# Altium project Length Bar Comparator.PrjPcb (part 1 of 3)
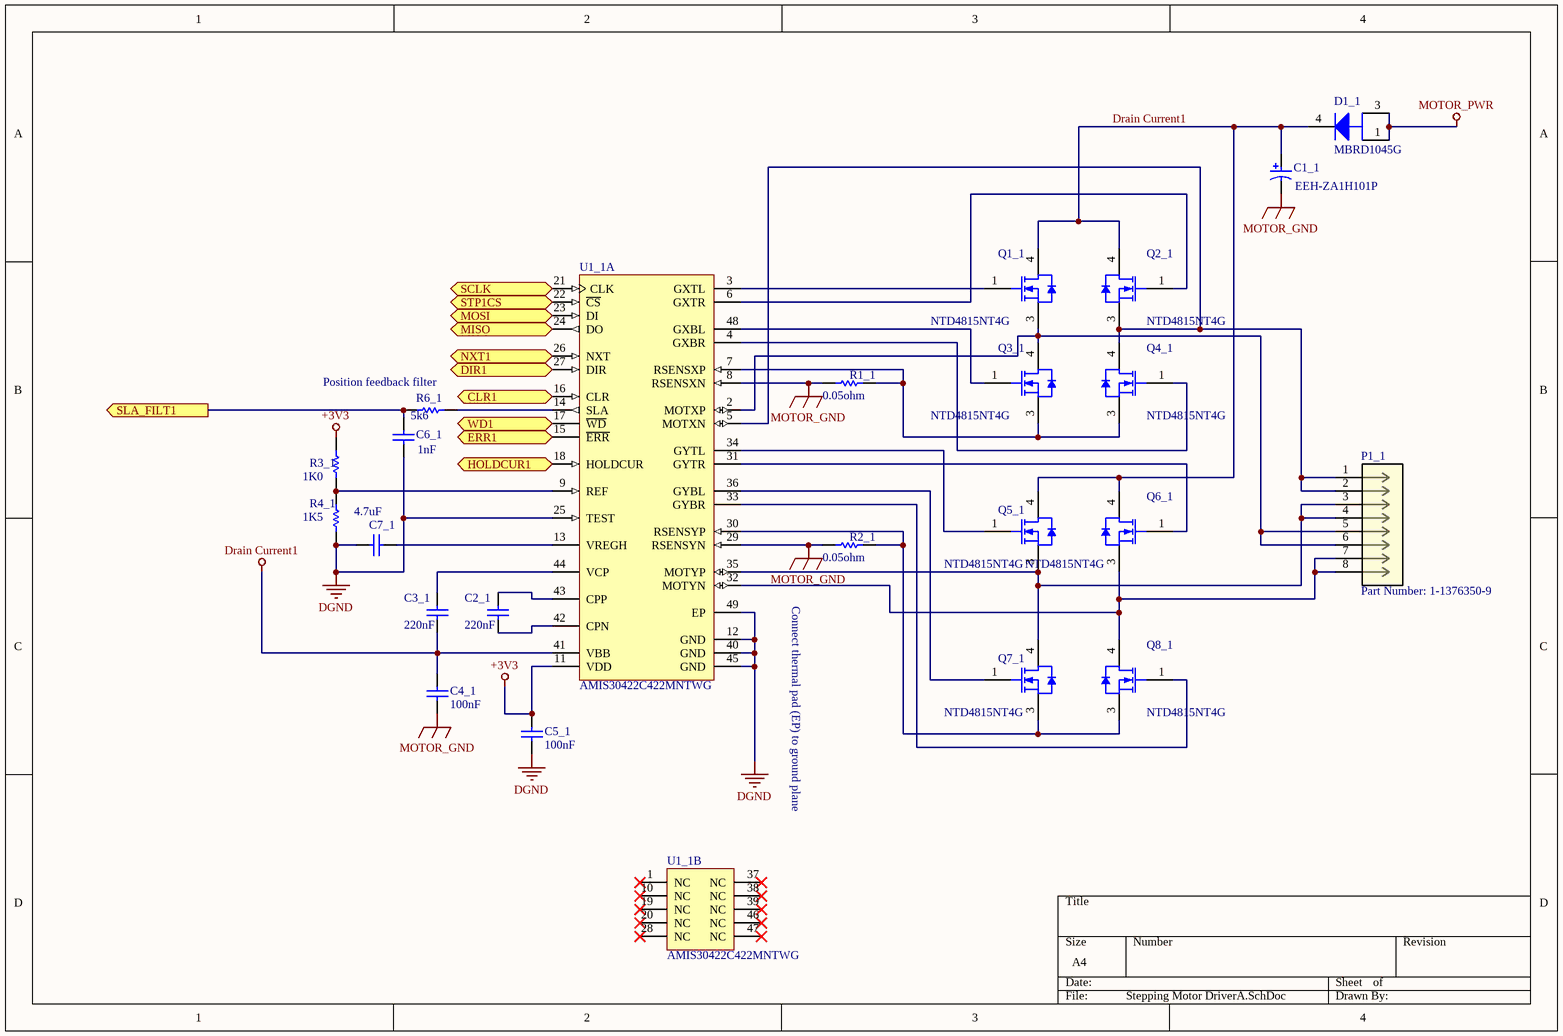
[diagram p0: Stepping Motor DriverA.SchDoc]
11 sheets, 462 parts. Net scope: flat (ports and power ports of the same name join across sheets).
Board file: Length Bar Comparator.PcbDoc
Sheets:
  Stepping Motor DriverA.SchDoc
  Stepping Motor DriverB.SchDoc
  Stepping Motor DriverC.SchDoc
  Stepping Motor DriverD.SchDoc
  Stepping Motor DriverE.SchDoc
  Stepping Motor DriverF.SchDoc
  Microprocessor.SchDoc
  LVDT Driver.SchDoc
  Power Regulation.SchDoc
  Reference Voltage.SchDoc
  Amplifiers.SchDoc

## Sheet Stepping Motor DriverA.SchDoc
size A4

### Parts
C1_1  EEH-ZA1H101P  [PNSC-ZA-G_L]
C2_1  value 220nF  [CAPC0805(2012)75_L]  (hidden comment: CAP 220nF 50V 0805(2012))
C3_1  value 220nF  [CAPC0805(2012)75_L]  (hidden comment: CAP 220nF 50V 0805(2012))
C4_1  value 100nF  [CAPC1812(4532)110_N]  (hidden comment: CAP 100nF 50V 1812(4532))
C5_1  value 100nF  [CAPC1812(4532)110_N]  (hidden comment: CAP 100nF 50V 1812(4532))
C6_1  value 1nF  [CAPC1206(3216)170_N]  (hidden comment: CAP 1nF 50V 1206(3216))
C7_1  value 4.7uF  [CAPC2220(5750)230_L]  (hidden comment: CAP 4.7uF 50V 2220(5750))
D1_1  MBRD1045G  [ONSC-DPAK-3-369C-01_V]
P1_1  Part Number: 1-1376350-9  [conn8_1-1376350-]
Q1_1  NTD4815NT4G  [ONSC-DPAK-3-369AA-01_V]
Q2_1  NTD4815NT4G  [ONSC-DPAK-3-369AA-01_V]
Q3_1  NTD4815NT4G  [ONSC-DPAK-3-369AA-01_V]
Q4_1  NTD4815NT4G  [ONSC-DPAK-3-369AA-01_V]
Q5_1  NTD4815NT4G  [ONSC-DPAK-3-369AA-01_V]
Q6_1  NTD4815NT4G  [ONSC-DPAK-3-369AA-01_V]
Q7_1  NTD4815NT4G  [ONSC-DPAK-3-369AA-01_V]
Q8_1  NTD4815NT4G  [ONSC-DPAK-3-369AA-01_V]
R1_1  Resistance: 0.05ohm  [RESC6432X89X76LL25T25]  (hidden comment: WSL2512R0500FEA)
R2_1  Resistance: 0.05ohm  [RESC6432X89X76LL25T25]  (hidden comment: WSL2512R0500FEA)
R3_1  value 1K0  [RESC0805(2012)_M]  (hidden comment: 1K 1% 0805(2012))
R4_1  value 1K5  [RESC0805(2012)_M]  (hidden comment: 1K5 1% 0805(2012))
R6_1  value 5k6  [RESC0805(2012)_L]  (hidden comment: 5K6 1% 0805(2012))
U1_1  AMIS30422C422MNTWG  [ONSC-QFN-48-485AJ-01_V]  (parts A,B of 2)

### Ports
CLR1 (in), DIR1 (in), ERR1 (out), HOLDCUR1 (in), MISO (out), MOSI (in), NXT1 (in), SCLK (in), SLA_FILT1 (out), STP1CS (in), WD1 (out)

### Nets
+3V3: C5_1.2 R3_1.2 U1_1.11(VDD)
DGND: C5_1.1 C6_1.1 C7_1.1 R4_1.1 U1_1.12(GND) U1_1.25(TEST) U1_1.40(GND) U1_1.45(GND) U1_1.49(EP)
Drain Current1: C1_1.1 C3_1.1 C4_1.2 D1_1.4(K) Q1_1.4(D) Q2_1.4(D) Q5_1.4(D) Q6_1.4(D) U1_1.41(VBB)
MOTOR_GND: C1_1.2 C4_1.1 R1_1.1 R2_1.1 U1_1.8(RSENSXN) U1_1.29(RSENSYN)
MOTOR_PWR: D1_1.1(A) D1_1.3(A)
MISO: U1_1.24(DO) ; port MISO
MOSI: U1_1.23(DI) ; port MOSI
SCLK: U1_1.21(CLK) ; port SCLK
NetC2_1_1: C2_1.1 U1_1.42(CPN)
NetC2_1_2: C2_1.2 U1_1.43(CPP)
NetC3_1_2: C3_1.2 U1_1.44(VCP)
NetC6_1_2: C6_1.2 R6_1.1 ; port SLA_FILT1
NetC7_1_2: C7_1.2 U1_1.13(VREGH)
NetP1_1_1: P1_1.1 P1_1.2 Q2_1.3(S) Q4_1.4(D) U1_1.5(MOTXN)
NetP1_1_3: P1_1.3 P1_1.4 Q5_1.3(S) Q7_1.4(D) U1_1.35(MOTYP)
NetP1_1_5: P1_1.5 P1_1.6 Q1_1.3(S) Q3_1.4(D) U1_1.2(MOTXP)
NetP1_1_7: P1_1.7 P1_1.8 Q6_1.3(S) Q8_1.4(D) U1_1.32(MOTYN)
NetQ1_1_1: Q1_1.1(G) U1_1.3(GXTL)
NetQ2_1_1: Q2_1.1(G) U1_1.6(GXTR)
NetQ3_1_1: Q3_1.1(G) U1_1.48(GXBL)
NetQ3_1_3: Q3_1.3(S) Q4_1.3(S) R1_1.2 U1_1.7(RSENSXP)
NetQ4_1_1: Q4_1.1(G) U1_1.4(GXBR)
NetQ5_1_1: Q5_1.1(G) U1_1.34(GYTL)
NetQ6_1_1: Q6_1.1(G) U1_1.31(GYTR)
NetQ7_1_1: Q7_1.1(G) U1_1.36(GYBL)
NetQ7_1_3: Q7_1.3(S) Q8_1.3(S) R2_1.2 U1_1.30(RSENSYP)
NetQ8_1_1: Q8_1.1(G) U1_1.33(GYBR)
NetR3_1_1: R3_1.1 R4_1.2 U1_1.9(REF)
NetR6_1_2: R6_1.2 U1_1.14(SLA)
NetU1_1_15: U1_1.15(~{ERR}) ; port ERR1
NetU1_1_16: U1_1.16(CLR) ; port CLR1
NetU1_1_17: U1_1.17(~{WD}) ; port WD1
NetU1_1_18: U1_1.18(HOLDCUR) ; port HOLDCUR1
NetU1_1_22: U1_1.22(~{CS}) ; port STP1CS
NetU1_1_26: U1_1.26(NXT) ; port NXT1
NetU1_1_27: U1_1.27(DIR) ; port DIR1

Not connected (* = marked no-connect by the designer): U1_1 1(NC)* 10(NC)* 19(NC)* 20(NC)* 28(NC)* 37(NC)* 38(NC)* 39(NC)* 46(NC)* 47(NC)*

### Notes on the sheet
- (near R6_1) Position feedback filter
- Connect thermal pad (EP) to ground plane

### Library data of the parts
C1_1 = CMP-2000-06221-1: Conductive Polymer Hybrid Aluminum Electrolytic Capacitor, 100 uF, +/- 20%, 50 V, -55 to 105 degC, 2-Pin SMD (G), RoHS, Tape and Reel; Case Height: 10.5mm; Voltage Rating DC: 50V; Case Diameter: 10mm; Ripple Current: 2A; Load Life: 10000Hour; Brand: Panasonic; Case Length: 10.2mm; ESR: 28mOhms; Capacitance: 100uF; Manufacturer URL: http://www.panasonic.com/; Minimum Operating Temperature: -55C; Datasheet Version: 06/2016; Product Category: AluminumOrganicPolymerCapacitors; Maximum Operating Temperature: +105C; Package Description: 2-Pin Surface Mount Device, Body 10.3 x 10.3 mm; Package Reference: ZA-G; RoHS: Details; Series: ZA; Tolerance: 20%; Product: AluminumElectrolyticCapacitors; Factory Pack Quantity: 500; Manufacturer: Panasonic; Termination Style: SMD/SMT; Datasheet URL: https://industrial.panasonic.com/cdbs/www-data/pdf/RDD0000/DMD0000COL56.pdf; Mounting Technology: SurfaceMount; Packaging: Reel; Height: 10.5mm
C2_1 C3_1 = CMP-1036-04556-1: CAP 220nF 50V -20% to +80% 0805 (2012 Metric) Thickness 0.75mm SMD; Case-Metric: 2012; Case-EIA: 0805; Technology: SMT; Max Thickness: 0.75 mm; Rated Voltage: 50 V; Tolerance: -20% to +80%
C4_1 C5_1 = CMP-1040-01292-1: CAP 100nF 50V ±20% 1812 (4532 Metric) Thickness 1.1mm SMD; Case-EIA: 1812; Tolerance: Â±20%; Case-Metric: 4532; Rated Voltage: 50 V; Technology: SMT; Max Thickness: 1.1 mm
C6_1 = CMP-1037-02447-1: CAP 1nF 50V ±2% 1206 (3216 Metric) Thickness 1.7mm SMD; Case-Metric: 3216; Case-EIA: 1206; Tolerance: Â±2%; Technology: SMT; Max Thickness: 1.7 mm; Rated Voltage: 50 V
C7_1 = CMP-1042-00755-1: CAP 4.7uF 50V ±10% 2220 (5750 Metric) Thickness 2.2mm SMD; Case-Metric: 5750; Tolerance: Â±10%; Case-EIA: 2220; Rated Voltage: 50 V; Max Thickness: 2.2 mm; Technology: SMT
D1_1 = CMP-1055-00174-1: SWITCHMODE(TM) Schottky Power Rectifier, 3-Pin DPAK, Pb-Free, Tube; Manufacturer: On Semiconductor; Note1: 0; IFSM Max (A): 70; Configuration: Single; ComponentLink2URL: http://www.onsemi.cn/pub_link/Collateral/MBRB1045-D.PDF; PackageVersion: Rev. E, 02/2014; PackageDescription: 3-Pin Flange Mount, Body 6.54 x 6.095 mm, Pitch 2.29 mm; ComponentLink2Description: Datasheet; Packing: Tube; RoHS: TRUE; ComponentLink3Description: Package Specification; PackageReference: DPAK-3-369C-01; ComponentLink1URL: http://www.onsemi.com/; DatasheetVersion: Rev. 8; ComponentLink1Description: Manufacturer URL; PartNumber: MBRD1045G; Mounting Technology: Surface Mount; ComponentLink3URL: http://www.onsemi.cn/pub_link/Collateral/369C.PDF
P1_1 = 1-1376350-9: 025 8POS CAP ASSY H TIN; Vendor: TE Connectivity; Built_By: Digital_Papaya_Team; ROWS/CONFIG: 2; PITCH(MM): 0.087; POSITIONS: 8; Copyright: Copyright (C) 2018 Accelerated Designs. All rights reserved; Manufacturer_Part_Number: 1-1376350-9; Datasheet: https://www.te.com/commerce/DocumentDelivery/DDEController?Action=showdoc&DocId=Customer+Drawing%7F1376350%7FD5%7Fpdf%7FJapanese%7FJPN_CD_1376350_D5.pdf%7F1-1376350-2; TE_Part_Number: 1-1376350-9; PRODUCT: -; Type: DEV; RefDes: RefDes; Value: Value
Q1_1 Q2_1 Q3_1 Q4_1 Q5_1 Q6_1 Q7_1 Q8_1 = CMP-1058-00298-1: Power MOSFET, 30 V, 35 A, Single N-Channel, 3-Pin DPAK, Pb-Free, Tape and Reel; Manufacturer: On Semiconductor; VGS(th) Max (V): 2.5; VGS Max (V): 20; ID Max (A): 35; Crss Typ (pF): 108; Coss Typ (pF): 181; Channel Polarity: N Channel; V(BR)DSS Min (V): 30; Ciss Typ (pF): 770; Qrr Typ (nC): 5.5; RoHS: Pb-Free; ComponentLink3Description: Package Specification; ComponentLink2URL: http://www.onsemi.cn/pub_link/Collateral/NTD4815N-D.PDF; ComponentLink1Description: Manufacturer URL; DatasheetVersion: Rev. 7; ComponentLink3URL: http://www.onsemi.cn/pub_link/Collateral/369AA.PDF; Package Type: DPAK-3, IPAK-3; PartNumber: NTD4815NT4G; Configuration: Single; PackageVersion: Rev. B, 06/2010; ComponentLink2Description: Datasheet; Mounting Technology: Surface Mount; PackageReference: DPAK-3-369AA-01; ComponentLink1URL: http://www.onsemi.com/; PackageDescription: 3-Pin Flange Mount, Body 6.54 x 6.095 mm, Pitch 2.29 mm; Packing: Tape and Reel
R1_1 R2_1 = CMP-2000-07420-1: Chip Resistor, 50 mOhm, +/- 1%, 1 W, -65 to 170 degC, 2512 (6432 Metric), RoHS, Tape and Reel; Manufacturer: Vishay; Power Rating: 1W; Automotive Qualification Standard: AEC-Q200; Temperature Coefficient: ±75ppm/°C; Resistor Case Style: 2512[6432Metric]; SVHC: NoSVHC(15-Jun-2015); Product Range: WSLSeries; Resistor Element Type: MetalStrip; Manufacturer URL: http://www.vishay.com/; Datasheet Version: 07/2016; Package Reference: 2512; Resistance Tolerance: ±1%; Datasheet URL: http://www.vishay.com/docs/30100/wsl.pdf; Mounting Technology: SurfaceMount; MSL: MSL1-Unlimited; Package Description: 2-Pin Surface Mount Device, Body 6.35 x 3.18 mm; Packaging: CutTape
R3_1 = CMP-1013-00510-1: 1K 0.125W 1% 0805 (2012 Metric)  SMD; Case-Metric: 2012; Case-EIA: 0805; Tolerance: 1 %; Power: 0.125 W; Technology: SMT
R4_1 = CMP-1013-00528-1: 1K5 0.125W 1% 0805 (2012 Metric)  SMD; Case-Metric: 2012; Case-EIA: 0805; Technology: SMT; Power: 0.125 W; Tolerance: 1 %
R6_1 = CMP-1013-00595-1: 5K6 0.125W 1% 0805 (2012 Metric)  SMD; Case-EIA: 0805; Case-Metric: 2012; Technology: SMT; Power: 0.125 W; Tolerance: 1 %
U1_1 = CMP-1325-00002-1: Micro-Stepping Stepper Motor Bridge Controller, 6 to 30 V, -40 to 170 degC, 48-Pin QFN (485AJ-01), RoHS, Tape and Reel; Manufacturer: ON Semiconductor; IO Max (A): 15; Feedback Method: Back EMF/Sensorless; VCC Min (V): 6; IO Peak Max (A): 20; Current Sense: External Resistor; VCC Max (V): 30; ComponentLink1Description: Manufacturer URL; DatasheetVersion: Rev. 0; PackageDescription: 48-Pin Quad Flat No-Lead Package, Body 7 x 7 mm, Pitch 0.5 mm; Packing: Tape and Reel; Mounting Technology: Surface Mount; ComponentLink2Description: Datasheet; ComponentLink3URL: http://www.onsemi.cn/pub_link/Collateral/485AJ.PDF; Type: Stepper; ComponentLink2URL: http://www.onsemi.com/pub_link/Collateral/AMIS-30422-D.PDF; ComponentLink3Description: Package Specification; PackageReference: QFN-48-485AJ-01; PartNumber: AMIS30422C422MNTWG; PackageVersion: Rev. O; ComponentLink1URL: http://www.onsemi.com/; RoHS: TRUE; PartId: 1

## Sheet Stepping Motor DriverB.SchDoc
size A4
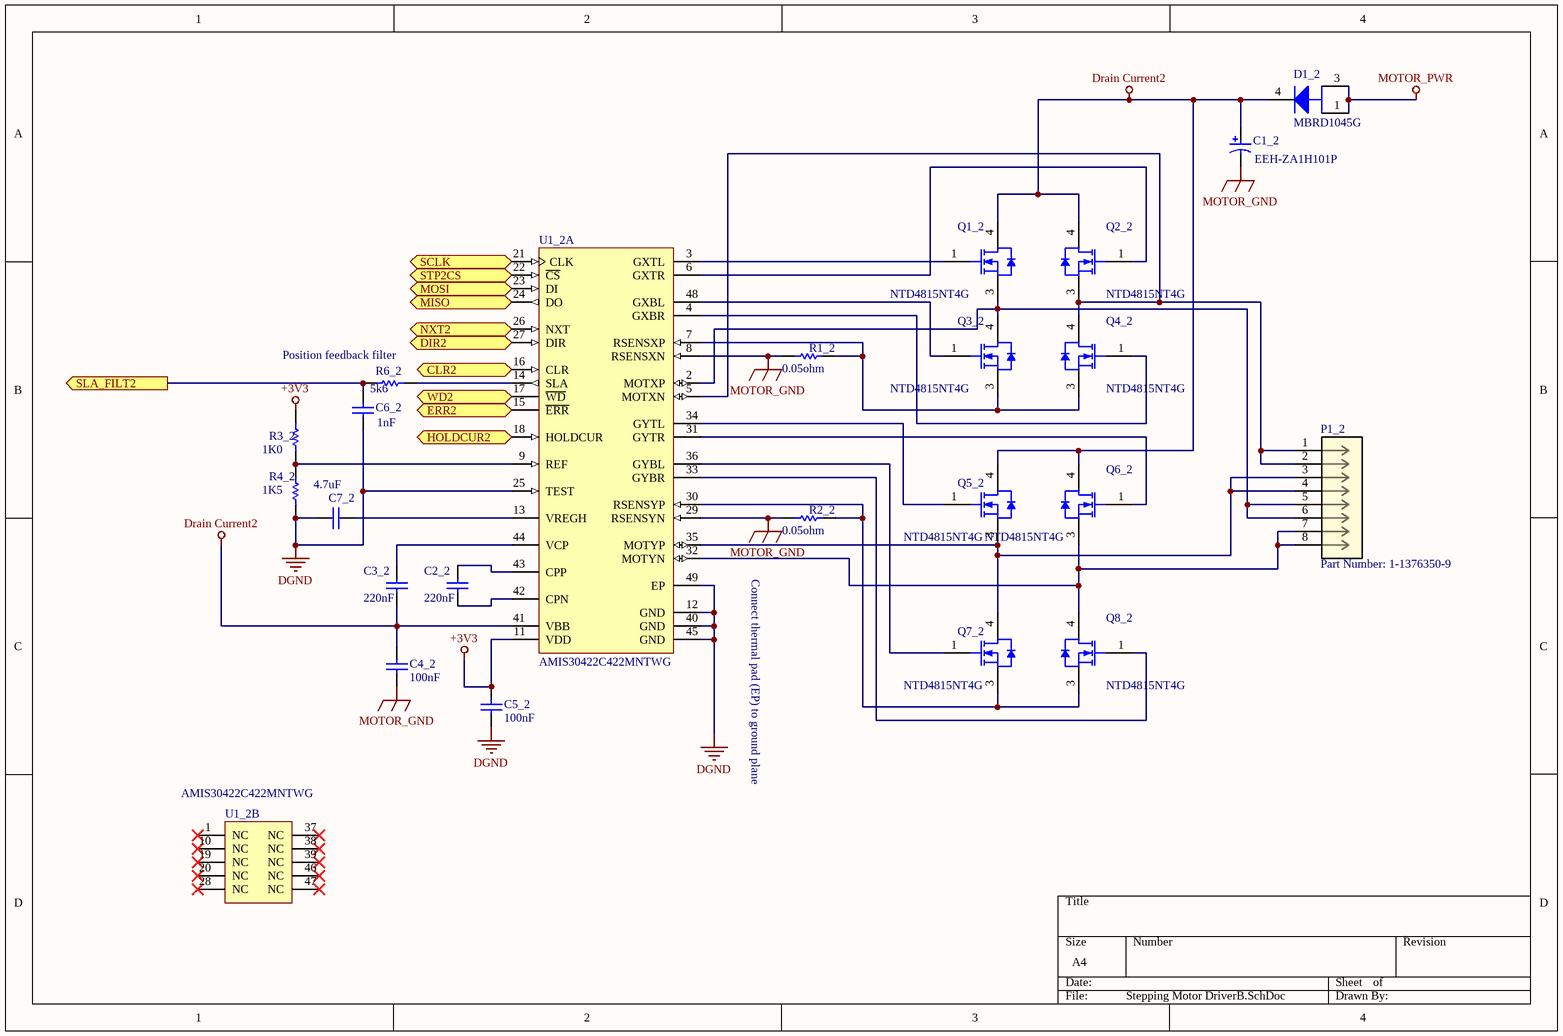
[diagram p1: Stepping Motor DriverB.SchDoc]

### Parts
C1_2  EEH-ZA1H101P  [PNSC-ZA-G_L]
C2_2  value 220nF  [CAPC0805(2012)75_L]  (hidden comment: CAP 220nF 50V 0805(2012))
C3_2  value 220nF  [CAPC0805(2012)75_L]  (hidden comment: CAP 220nF 50V 0805(2012))
C4_2  value 100nF  [CAPC1812(4532)110_N]  (hidden comment: CAP 100nF 50V 1812(4532))
C5_2  value 100nF  [CAPC1812(4532)110_N]  (hidden comment: CAP 100nF 50V 1812(4532))
C6_2  value 1nF  [CAPC1206(3216)170_N]  (hidden comment: CAP 1nF 50V 1206(3216))
C7_2  value 4.7uF  [CAPC2220(5750)230_L]  (hidden comment: CAP 4.7uF 50V 2220(5750))
D1_2  MBRD1045G  [ONSC-DPAK-3-369C-01_V]
P1_2  Part Number: 1-1376350-9  [conn8_1-1376350-]
Q1_2  NTD4815NT4G  [ONSC-DPAK-3-369AA-01_V]
Q2_2  NTD4815NT4G  [ONSC-DPAK-3-369AA-01_V]
Q3_2  NTD4815NT4G  [ONSC-DPAK-3-369AA-01_V]
Q4_2  NTD4815NT4G  [ONSC-DPAK-3-369AA-01_V]
Q5_2  NTD4815NT4G  [ONSC-DPAK-3-369AA-01_V]
Q6_2  NTD4815NT4G  [ONSC-DPAK-3-369AA-01_V]
Q7_2  NTD4815NT4G  [ONSC-DPAK-3-369AA-01_V]
Q8_2  NTD4815NT4G  [ONSC-DPAK-3-369AA-01_V]
R1_2  Resistance: 0.05ohm  [RESC6432X89X76LL25T25]  (hidden comment: WSL2512R0500FEA)
R2_2  Resistance: 0.05ohm  [RESC6432X89X76LL25T25]  (hidden comment: WSL2512R0500FEA)
R3_2  value 1K0  [RESC0805(2012)_M]  (hidden comment: 1K 1% 0805(2012))
R4_2  value 1K5  [RESC0805(2012)_M]  (hidden comment: 1K5 1% 0805(2012))
R6_2  value 5k6  [RESC0805(2012)_L]  (hidden comment: 5K6 1% 0805(2012))
U1_2  AMIS30422C422MNTWG  [ONSC-QFN-48-485AJ-01_V]  (parts A,B of 2)

### Ports
CLR2 (in), DIR2 (in), ERR2 (out), HOLDCUR2 (in), MISO (out), MOSI (in), NXT2 (in), SCLK (in), SLA_FILT2 (out), STP2CS (in), WD2 (out)

### Nets
+3V3: C5_2.2 R3_2.2 U1_2.11(VDD)
DGND: C5_2.1 C6_2.1 C7_2.1 R4_2.1 U1_2.12(GND) U1_2.25(TEST) U1_2.40(GND) U1_2.45(GND) U1_2.49(EP)
Drain Current2: C1_2.1 C3_2.1 C4_2.2 D1_2.4(K) Q1_2.4(D) Q2_2.4(D) Q5_2.4(D) Q6_2.4(D) U1_2.41(VBB)
MOTOR_GND: C1_2.2 C4_2.1 R1_2.1 R2_2.1 U1_2.8(RSENSXN) U1_2.29(RSENSYN)
MOTOR_PWR: D1_2.1(A) D1_2.3(A)
MISO: U1_2.24(DO) ; port MISO
MOSI: U1_2.23(DI) ; port MOSI
SCLK: U1_2.21(CLK) ; port SCLK
NetC2_2_1: C2_2.1 U1_2.42(CPN)
NetC2_2_2: C2_2.2 U1_2.43(CPP)
NetC3_2_2: C3_2.2 U1_2.44(VCP)
NetC6_2_2: C6_2.2 R6_2.1 ; port SLA_FILT2
NetC7_2_2: C7_2.2 U1_2.13(VREGH)
NetP1_2_1: P1_2.1 P1_2.2 Q2_2.3(S) Q4_2.4(D) U1_2.5(MOTXN)
NetP1_2_3: P1_2.3 P1_2.4 Q5_2.3(S) Q7_2.4(D) U1_2.35(MOTYP)
NetP1_2_5: P1_2.5 P1_2.6 Q1_2.3(S) Q3_2.4(D) U1_2.2(MOTXP)
NetP1_2_7: P1_2.7 P1_2.8 Q6_2.3(S) Q8_2.4(D) U1_2.32(MOTYN)
NetQ1_2_1: Q1_2.1(G) U1_2.3(GXTL)
NetQ2_2_1: Q2_2.1(G) U1_2.6(GXTR)
NetQ3_2_1: Q3_2.1(G) U1_2.48(GXBL)
NetQ3_2_3: Q3_2.3(S) Q4_2.3(S) R1_2.2 U1_2.7(RSENSXP)
NetQ4_2_1: Q4_2.1(G) U1_2.4(GXBR)
NetQ5_2_1: Q5_2.1(G) U1_2.34(GYTL)
NetQ6_2_1: Q6_2.1(G) U1_2.31(GYTR)
NetQ7_2_1: Q7_2.1(G) U1_2.36(GYBL)
NetQ7_2_3: Q7_2.3(S) Q8_2.3(S) R2_2.2 U1_2.30(RSENSYP)
NetQ8_2_1: Q8_2.1(G) U1_2.33(GYBR)
NetR3_2_1: R3_2.1 R4_2.2 U1_2.9(REF)
NetR6_2_2: R6_2.2 U1_2.14(SLA)
NetU1_2_15: U1_2.15(~{ERR}) ; port ERR2
NetU1_2_16: U1_2.16(CLR) ; port CLR2
NetU1_2_17: U1_2.17(~{WD}) ; port WD2
NetU1_2_18: U1_2.18(HOLDCUR) ; port HOLDCUR2
NetU1_2_22: U1_2.22(~{CS}) ; port STP2CS
NetU1_2_26: U1_2.26(NXT) ; port NXT2
NetU1_2_27: U1_2.27(DIR) ; port DIR2

Not connected (* = marked no-connect by the designer): U1_2 1(NC)* 10(NC)* 19(NC)* 20(NC)* 28(NC)* 37(NC)* 38(NC)* 39(NC)* 46(NC)* 47(NC)*

### Notes on the sheet
- (near R6_2) Position feedback filter
- Connect thermal pad (EP) to ground plane

### Library data of the parts
C1_2 = CMP-2000-06221-1: as C1_1 on sheet Stepping Motor DriverA; Manufacturer URL: http://www.panasonic.com/; Minimum Operating Temperature: -55C; Datasheet Version: 06/2016; Product Category: AluminumOrganicPolymerCapacitors; Maximum Operating Temperature: +105C; Package Description: 2-Pin Surface Mount Device, Body 10.3 x 10.3 mm; Package Reference: ZA-G; RoHS: Details; Series: ZA; Tolerance: 20%; Product: AluminumElectrolyticCapacitors; Factory Pack Quantity: 500; Manufacturer: Panasonic; Termination Style: SMD/SMT; Datasheet URL: https://industrial.panasonic.com/cdbs/www-data/pdf/RDD0000/DMD0000COL56.pdf; Mounting Technology: SurfaceMount; Packaging: Reel; Height: 10.5mm
C2_2 C3_2 = CMP-1036-04556-1: as C2_1 on sheet Stepping Motor DriverA; Technology: SMT; Max Thickness: 0.75 mm; Rated Voltage: 50 V; Tolerance: -20% to +80%
C4_2 C5_2 = CMP-1040-01292-1: as C4_1 on sheet Stepping Motor DriverA; Rated Voltage: 50 V; Technology: SMT; Max Thickness: 1.1 mm
C6_2 = CMP-1037-02447-1: as C6_1 on sheet Stepping Motor DriverA; Technology: SMT; Max Thickness: 1.7 mm; Rated Voltage: 50 V
C7_2 = CMP-1042-00755-1: as C7_1 on sheet Stepping Motor DriverA; Rated Voltage: 50 V; Max Thickness: 2.2 mm; Technology: SMT
D1_2 = CMP-1055-00174-1: as D1_1 on sheet Stepping Motor DriverA; ComponentLink2URL: http://www.onsemi.cn/pub_link/Collateral/MBRB1045-D.PDF; PackageVersion: Rev. E, 02/2014; PackageDescription: 3-Pin Flange Mount, Body 6.54 x 6.095 mm, Pitch 2.29 mm; ComponentLink2Description: Datasheet; Packing: Tube; RoHS: TRUE; ComponentLink3Description: Package Specification; PackageReference: DPAK-3-369C-01; ComponentLink1URL: http://www.onsemi.com/; DatasheetVersion: Rev. 8; ComponentLink1Description: Manufacturer URL; PartNumber: MBRD1045G; Mounting Technology: Surface Mount; ComponentLink3URL: http://www.onsemi.cn/pub_link/Collateral/369C.PDF
P1_2 = 1-1376350-9: as P1_1 on sheet Stepping Motor DriverA; Copyright: Copyright (C) 2018 Accelerated Designs. All rights reserved; Manufacturer_Part_Number: 1-1376350-9; Datasheet: https://www.te.com/commerce/DocumentDelivery/DDEController?Action=showdoc&DocId=Customer+Drawing%7F1376350%7FD5%7Fpdf%7FJapanese%7FJPN_CD_1376350_D5.pdf%7F1-1376350-2; TE_Part_Number: 1-1376350-9; PRODUCT: -; Type: DEV; RefDes: RefDes; Value: Value
Q1_2 Q2_2 Q3_2 Q4_2 Q5_2 Q6_2 Q7_2 Q8_2 = CMP-1058-00298-1: as Q1_1 on sheet Stepping Motor DriverA; RoHS: Pb-Free; ComponentLink3Description: Package Specification; ComponentLink2URL: http://www.onsemi.cn/pub_link/Collateral/NTD4815N-D.PDF; ComponentLink1Description: Manufacturer URL; DatasheetVersion: Rev. 7; ComponentLink3URL: http://www.onsemi.cn/pub_link/Collateral/369AA.PDF; Package Type: DPAK-3, IPAK-3; PartNumber: NTD4815NT4G; Configuration: Single; PackageVersion: Rev. B, 06/2010; ComponentLink2Description: Datasheet; Mounting Technology: Surface Mount; PackageReference: DPAK-3-369AA-01; ComponentLink1URL: http://www.onsemi.com/; PackageDescription: 3-Pin Flange Mount, Body 6.54 x 6.095 mm, Pitch 2.29 mm; Packing: Tape and Reel
R1_2 R2_2 = CMP-2000-07420-1: as R1_1 on sheet Stepping Motor DriverA; Manufacturer URL: http://www.vishay.com/; Datasheet Version: 07/2016; Package Reference: 2512; Resistance Tolerance: ±1%; Datasheet URL: http://www.vishay.com/docs/30100/wsl.pdf; Mounting Technology: SurfaceMount; MSL: MSL1-Unlimited; Package Description: 2-Pin Surface Mount Device, Body 6.35 x 3.18 mm; Packaging: CutTape
R3_2 = CMP-1013-00510-1: as R3_1 on sheet Stepping Motor DriverA; Tolerance: 1 %; Power: 0.125 W; Technology: SMT
R4_2 = CMP-1013-00528-1: as R4_1 on sheet Stepping Motor DriverA; Technology: SMT; Power: 0.125 W; Tolerance: 1 %
R6_2 = CMP-1013-00595-1: as R6_1 on sheet Stepping Motor DriverA; Technology: SMT; Power: 0.125 W; Tolerance: 1 %
U1_2 = CMP-1325-00002-1: as U1_1 on sheet Stepping Motor DriverA; ComponentLink1Description: Manufacturer URL; DatasheetVersion: Rev. 0; PackageDescription: 48-Pin Quad Flat No-Lead Package, Body 7 x 7 mm, Pitch 0.5 mm; Packing: Tape and Reel; Mounting Technology: Surface Mount; ComponentLink2Description: Datasheet; ComponentLink3URL: http://www.onsemi.cn/pub_link/Collateral/485AJ.PDF; Type: Stepper; ComponentLink2URL: http://www.onsemi.com/pub_link/Collateral/AMIS-30422-D.PDF; ComponentLink3Description: Package Specification; PackageReference: QFN-48-485AJ-01; PartNumber: AMIS30422C422MNTWG; PackageVersion: Rev. O; ComponentLink1URL: http://www.onsemi.com/; RoHS: TRUE; PartId: 1

## Sheet Stepping Motor DriverC.SchDoc
size A4
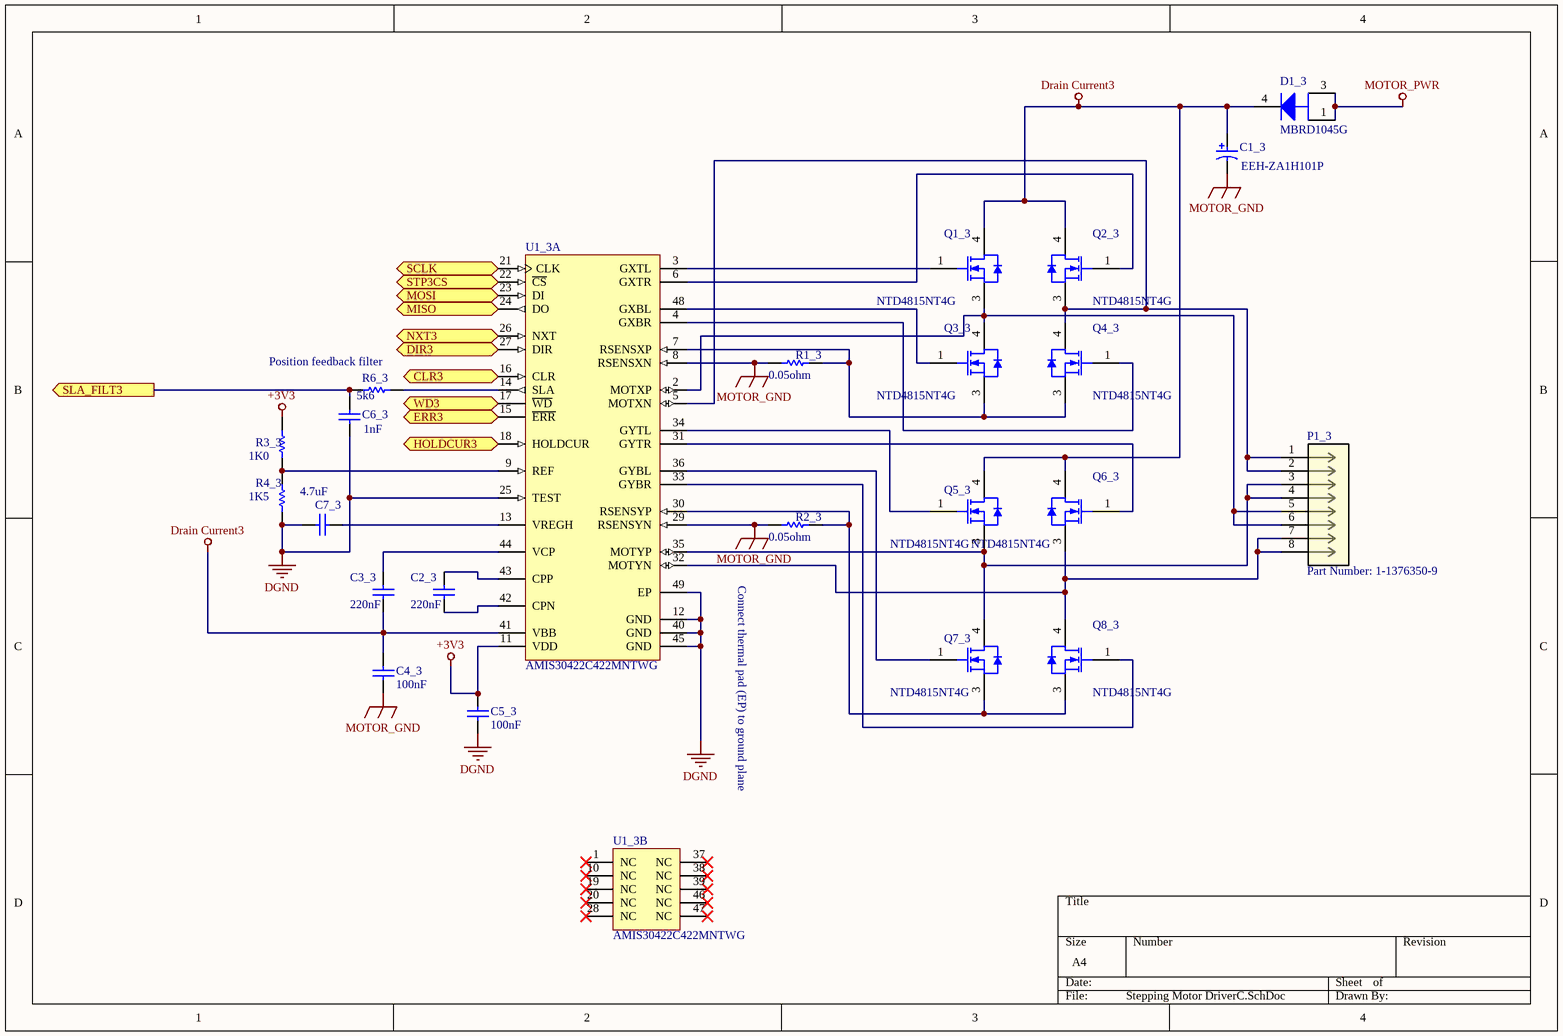
[diagram p2: Stepping Motor DriverC.SchDoc]

### Parts
C1_3  EEH-ZA1H101P  [PNSC-ZA-G_L]
C2_3  value 220nF  [CAPC0805(2012)75_L]  (hidden comment: CAP 220nF 50V 0805(2012))
C3_3  value 220nF  [CAPC0805(2012)75_L]  (hidden comment: CAP 220nF 50V 0805(2012))
C4_3  value 100nF  [CAPC1812(4532)110_N]  (hidden comment: CAP 100nF 50V 1812(4532))
C5_3  value 100nF  [CAPC1812(4532)110_N]  (hidden comment: CAP 100nF 50V 1812(4532))
C6_3  value 1nF  [CAPC1206(3216)170_N]  (hidden comment: CAP 1nF 50V 1206(3216))
C7_3  value 4.7uF  [CAPC2220(5750)230_L]  (hidden comment: CAP 4.7uF 50V 2220(5750))
D1_3  MBRD1045G  [ONSC-DPAK-3-369C-01_V]
P1_3  Part Number: 1-1376350-9  [conn8_1-1376350-]
Q1_3  NTD4815NT4G  [ONSC-DPAK-3-369AA-01_V]
Q2_3  NTD4815NT4G  [ONSC-DPAK-3-369AA-01_V]
Q3_3  NTD4815NT4G  [ONSC-DPAK-3-369AA-01_V]
Q4_3  NTD4815NT4G  [ONSC-DPAK-3-369AA-01_V]
Q5_3  NTD4815NT4G  [ONSC-DPAK-3-369AA-01_V]
Q6_3  NTD4815NT4G  [ONSC-DPAK-3-369AA-01_V]
Q7_3  NTD4815NT4G  [ONSC-DPAK-3-369AA-01_V]
Q8_3  NTD4815NT4G  [ONSC-DPAK-3-369AA-01_V]
R1_3  Resistance: 0.05ohm  [RESC6432X89X76LL25T25]  (hidden comment: WSL2512R0500FEA)
R2_3  Resistance: 0.05ohm  [RESC6432X89X76LL25T25]  (hidden comment: WSL2512R0500FEA)
R3_3  value 1K0  [RESC0805(2012)_M]  (hidden comment: 1K 1% 0805(2012))
R4_3  value 1K5  [RESC0805(2012)_M]  (hidden comment: 1K5 1% 0805(2012))
R6_3  value 5k6  [RESC0805(2012)_L]  (hidden comment: 5K6 1% 0805(2012))
U1_3  AMIS30422C422MNTWG  [ONSC-QFN-48-485AJ-01_V]  (parts A,B of 2)

### Ports
CLR3 (in), DIR3 (in), ERR3 (out), HOLDCUR3 (in), MISO (out), MOSI (in), NXT3 (in), SCLK (in), SLA_FILT3 (out), STP3CS (in), WD3 (out)

### Nets
+3V3: C5_3.2 R3_3.2 U1_3.11(VDD)
DGND: C5_3.1 C6_3.1 C7_3.1 R4_3.1 U1_3.12(GND) U1_3.25(TEST) U1_3.40(GND) U1_3.45(GND) U1_3.49(EP)
Drain Current3: C1_3.1 C3_3.1 C4_3.2 D1_3.4(K) Q1_3.4(D) Q2_3.4(D) Q5_3.4(D) Q6_3.4(D) U1_3.41(VBB)
MOTOR_GND: C1_3.2 C4_3.1 R1_3.1 R2_3.1 U1_3.8(RSENSXN) U1_3.29(RSENSYN)
MOTOR_PWR: D1_3.1(A) D1_3.3(A)
MISO: U1_3.24(DO) ; port MISO
MOSI: U1_3.23(DI) ; port MOSI
SCLK: U1_3.21(CLK) ; port SCLK
NetC2_3_1: C2_3.1 U1_3.42(CPN)
NetC2_3_2: C2_3.2 U1_3.43(CPP)
NetC3_3_2: C3_3.2 U1_3.44(VCP)
NetC6_3_2: C6_3.2 R6_3.1 ; port SLA_FILT3
NetC7_3_2: C7_3.2 U1_3.13(VREGH)
NetP1_3_1: P1_3.1 P1_3.2 Q2_3.3(S) Q4_3.4(D) U1_3.5(MOTXN)
NetP1_3_3: P1_3.3 P1_3.4 Q5_3.3(S) Q7_3.4(D) U1_3.35(MOTYP)
NetP1_3_5: P1_3.5 P1_3.6 Q1_3.3(S) Q3_3.4(D) U1_3.2(MOTXP)
NetP1_3_7: P1_3.7 P1_3.8 Q6_3.3(S) Q8_3.4(D) U1_3.32(MOTYN)
NetQ1_3_1: Q1_3.1(G) U1_3.3(GXTL)
NetQ2_3_1: Q2_3.1(G) U1_3.6(GXTR)
NetQ3_3_1: Q3_3.1(G) U1_3.48(GXBL)
NetQ3_3_3: Q3_3.3(S) Q4_3.3(S) R1_3.2 U1_3.7(RSENSXP)
NetQ4_3_1: Q4_3.1(G) U1_3.4(GXBR)
NetQ5_3_1: Q5_3.1(G) U1_3.34(GYTL)
NetQ6_3_1: Q6_3.1(G) U1_3.31(GYTR)
NetQ7_3_1: Q7_3.1(G) U1_3.36(GYBL)
NetQ7_3_3: Q7_3.3(S) Q8_3.3(S) R2_3.2 U1_3.30(RSENSYP)
NetQ8_3_1: Q8_3.1(G) U1_3.33(GYBR)
NetR3_3_1: R3_3.1 R4_3.2 U1_3.9(REF)
NetR6_3_2: R6_3.2 U1_3.14(SLA)
NetU1_3_15: U1_3.15(~{ERR}) ; port ERR3
NetU1_3_16: U1_3.16(CLR) ; port CLR3
NetU1_3_17: U1_3.17(~{WD}) ; port WD3
NetU1_3_18: U1_3.18(HOLDCUR) ; port HOLDCUR3
NetU1_3_22: U1_3.22(~{CS}) ; port STP3CS
NetU1_3_26: U1_3.26(NXT) ; port NXT3
NetU1_3_27: U1_3.27(DIR) ; port DIR3

Not connected (* = marked no-connect by the designer): U1_3 1(NC)* 10(NC)* 19(NC)* 20(NC)* 28(NC)* 37(NC)* 38(NC)* 39(NC)* 46(NC)* 47(NC)*

### Notes on the sheet
- (near R6_3) Position feedback filter
- Connect thermal pad (EP) to ground plane

### Library data of the parts
C1_3 = CMP-2000-06221-1: as C1_1 on sheet Stepping Motor DriverA; Manufacturer URL: http://www.panasonic.com/; Minimum Operating Temperature: -55C; Datasheet Version: 06/2016; Product Category: AluminumOrganicPolymerCapacitors; Maximum Operating Temperature: +105C; Package Description: 2-Pin Surface Mount Device, Body 10.3 x 10.3 mm; Package Reference: ZA-G; RoHS: Details; Series: ZA; Tolerance: 20%; Product: AluminumElectrolyticCapacitors; Factory Pack Quantity: 500; Manufacturer: Panasonic; Termination Style: SMD/SMT; Datasheet URL: https://industrial.panasonic.com/cdbs/www-data/pdf/RDD0000/DMD0000COL56.pdf; Mounting Technology: SurfaceMount; Packaging: Reel; Height: 10.5mm
C2_3 C3_3 = CMP-1036-04556-1: as C2_1 on sheet Stepping Motor DriverA; Technology: SMT; Max Thickness: 0.75 mm; Rated Voltage: 50 V; Tolerance: -20% to +80%
C4_3 C5_3 = CMP-1040-01292-1: as C4_1 on sheet Stepping Motor DriverA; Rated Voltage: 50 V; Technology: SMT; Max Thickness: 1.1 mm
C6_3 = CMP-1037-02447-1: as C6_1 on sheet Stepping Motor DriverA; Technology: SMT; Max Thickness: 1.7 mm; Rated Voltage: 50 V
C7_3 = CMP-1042-00755-1: as C7_1 on sheet Stepping Motor DriverA; Rated Voltage: 50 V; Max Thickness: 2.2 mm; Technology: SMT
D1_3 = CMP-1055-00174-1: as D1_1 on sheet Stepping Motor DriverA; ComponentLink2URL: http://www.onsemi.cn/pub_link/Collateral/MBRB1045-D.PDF; PackageVersion: Rev. E, 02/2014; PackageDescription: 3-Pin Flange Mount, Body 6.54 x 6.095 mm, Pitch 2.29 mm; ComponentLink2Description: Datasheet; Packing: Tube; RoHS: TRUE; ComponentLink3Description: Package Specification; PackageReference: DPAK-3-369C-01; ComponentLink1URL: http://www.onsemi.com/; DatasheetVersion: Rev. 8; ComponentLink1Description: Manufacturer URL; PartNumber: MBRD1045G; Mounting Technology: Surface Mount; ComponentLink3URL: http://www.onsemi.cn/pub_link/Collateral/369C.PDF
P1_3 = 1-1376350-9: as P1_1 on sheet Stepping Motor DriverA; Copyright: Copyright (C) 2018 Accelerated Designs. All rights reserved; Manufacturer_Part_Number: 1-1376350-9; Datasheet: https://www.te.com/commerce/DocumentDelivery/DDEController?Action=showdoc&DocId=Customer+Drawing%7F1376350%7FD5%7Fpdf%7FJapanese%7FJPN_CD_1376350_D5.pdf%7F1-1376350-2; TE_Part_Number: 1-1376350-9; PRODUCT: -; Type: DEV; RefDes: RefDes; Value: Value
Q1_3 Q2_3 Q3_3 Q4_3 Q5_3 Q6_3 Q7_3 Q8_3 = CMP-1058-00298-1: as Q1_1 on sheet Stepping Motor DriverA; RoHS: Pb-Free; ComponentLink3Description: Package Specification; ComponentLink2URL: http://www.onsemi.cn/pub_link/Collateral/NTD4815N-D.PDF; ComponentLink1Description: Manufacturer URL; DatasheetVersion: Rev. 7; ComponentLink3URL: http://www.onsemi.cn/pub_link/Collateral/369AA.PDF; Package Type: DPAK-3, IPAK-3; PartNumber: NTD4815NT4G; Configuration: Single; PackageVersion: Rev. B, 06/2010; ComponentLink2Description: Datasheet; Mounting Technology: Surface Mount; PackageReference: DPAK-3-369AA-01; ComponentLink1URL: http://www.onsemi.com/; PackageDescription: 3-Pin Flange Mount, Body 6.54 x 6.095 mm, Pitch 2.29 mm; Packing: Tape and Reel
R1_3 R2_3 = CMP-2000-07420-1: as R1_1 on sheet Stepping Motor DriverA; Manufacturer URL: http://www.vishay.com/; Datasheet Version: 07/2016; Package Reference: 2512; Resistance Tolerance: ±1%; Datasheet URL: http://www.vishay.com/docs/30100/wsl.pdf; Mounting Technology: SurfaceMount; MSL: MSL1-Unlimited; Package Description: 2-Pin Surface Mount Device, Body 6.35 x 3.18 mm; Packaging: CutTape
R3_3 = CMP-1013-00510-1: as R3_1 on sheet Stepping Motor DriverA; Tolerance: 1 %; Power: 0.125 W; Technology: SMT
R4_3 = CMP-1013-00528-1: as R4_1 on sheet Stepping Motor DriverA; Technology: SMT; Power: 0.125 W; Tolerance: 1 %
R6_3 = CMP-1013-00595-1: as R6_1 on sheet Stepping Motor DriverA; Technology: SMT; Power: 0.125 W; Tolerance: 1 %
U1_3 = CMP-1325-00002-1: as U1_1 on sheet Stepping Motor DriverA; ComponentLink1Description: Manufacturer URL; DatasheetVersion: Rev. 0; PackageDescription: 48-Pin Quad Flat No-Lead Package, Body 7 x 7 mm, Pitch 0.5 mm; Packing: Tape and Reel; Mounting Technology: Surface Mount; ComponentLink2Description: Datasheet; ComponentLink3URL: http://www.onsemi.cn/pub_link/Collateral/485AJ.PDF; Type: Stepper; ComponentLink2URL: http://www.onsemi.com/pub_link/Collateral/AMIS-30422-D.PDF; ComponentLink3Description: Package Specification; PackageReference: QFN-48-485AJ-01; PartNumber: AMIS30422C422MNTWG; PackageVersion: Rev. O; ComponentLink1URL: http://www.onsemi.com/; RoHS: TRUE; PartId: 1

## Sheet Stepping Motor DriverD.SchDoc
size A4
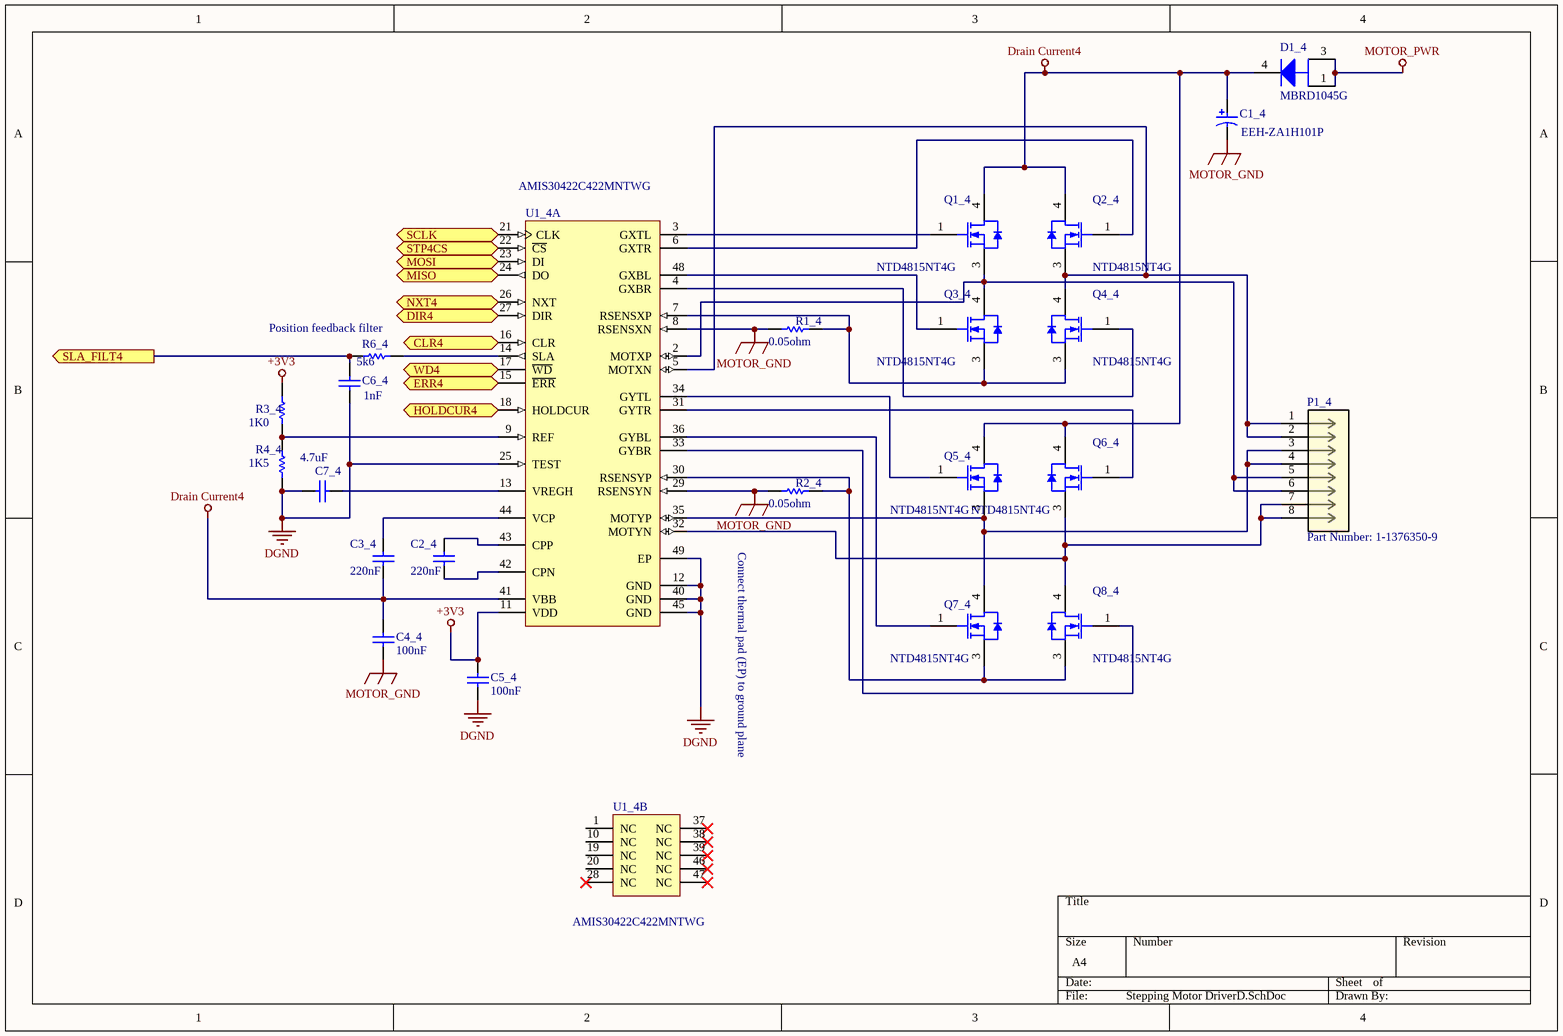
[diagram p3: Stepping Motor DriverD.SchDoc]

### Parts
C1_4  EEH-ZA1H101P  [PNSC-ZA-G_L]
C2_4  value 220nF  [CAPC0805(2012)75_L]  (hidden comment: CAP 220nF 50V 0805(2012))
C3_4  value 220nF  [CAPC0805(2012)75_L]  (hidden comment: CAP 220nF 50V 0805(2012))
C4_4  value 100nF  [CAPC1812(4532)110_N]  (hidden comment: CAP 100nF 50V 1812(4532))
C5_4  value 100nF  [CAPC1812(4532)110_N]  (hidden comment: CAP 100nF 50V 1812(4532))
C6_4  value 1nF  [CAPC1206(3216)170_N]  (hidden comment: CAP 1nF 50V 1206(3216))
C7_4  value 4.7uF  [CAPC2220(5750)230_L]  (hidden comment: CAP 4.7uF 50V 2220(5750))
D1_4  MBRD1045G  [ONSC-DPAK-3-369C-01_V]
P1_4  Part Number: 1-1376350-9  [conn8_1-1376350-]
Q1_4  NTD4815NT4G  [ONSC-DPAK-3-369AA-01_V]
Q2_4  NTD4815NT4G  [ONSC-DPAK-3-369AA-01_V]
Q3_4  NTD4815NT4G  [ONSC-DPAK-3-369AA-01_V]
Q4_4  NTD4815NT4G  [ONSC-DPAK-3-369AA-01_V]
Q5_4  NTD4815NT4G  [ONSC-DPAK-3-369AA-01_V]
Q6_4  NTD4815NT4G  [ONSC-DPAK-3-369AA-01_V]
Q7_4  NTD4815NT4G  [ONSC-DPAK-3-369AA-01_V]
Q8_4  NTD4815NT4G  [ONSC-DPAK-3-369AA-01_V]
R1_4  Resistance: 0.05ohm  [RESC6432X89X76LL25T25]  (hidden comment: WSL2512R0500FEA)
R2_4  Resistance: 0.05ohm  [RESC6432X89X76LL25T25]  (hidden comment: WSL2512R0500FEA)
R3_4  value 1K0  [RESC0805(2012)_M]  (hidden comment: 1K 1% 0805(2012))
R4_4  value 1K5  [RESC0805(2012)_M]  (hidden comment: 1K5 1% 0805(2012))
R6_4  value 5k6  [RESC0805(2012)_L]  (hidden comment: 5K6 1% 0805(2012))
U1_4  AMIS30422C422MNTWG  [ONSC-QFN-48-485AJ-01_V]  (parts A,B of 2)

### Ports
CLR4 (in), DIR4 (in), ERR4 (out), HOLDCUR4 (in), MISO (out), MOSI (in), NXT4 (in), SCLK (in), SLA_FILT4 (out), STP4CS (in), WD4 (out)

### Nets
+3V3: C5_4.2 R3_4.2 U1_4.11(VDD)
DGND: C5_4.1 C6_4.1 C7_4.1 R4_4.1 U1_4.12(GND) U1_4.25(TEST) U1_4.40(GND) U1_4.45(GND) U1_4.49(EP)
Drain Current4: C1_4.1 C3_4.1 C4_4.2 D1_4.4(K) Q1_4.4(D) Q2_4.4(D) Q5_4.4(D) Q6_4.4(D) U1_4.41(VBB)
MOTOR_GND: C1_4.2 C4_4.1 R1_4.1 R2_4.1 U1_4.8(RSENSXN) U1_4.29(RSENSYN)
MOTOR_PWR: D1_4.1(A) D1_4.3(A)
MISO: U1_4.24(DO) ; port MISO
MOSI: U1_4.23(DI) ; port MOSI
SCLK: U1_4.21(CLK) ; port SCLK
NetC2_4_1: C2_4.1 U1_4.42(CPN)
NetC2_4_2: C2_4.2 U1_4.43(CPP)
NetC3_4_2: C3_4.2 U1_4.44(VCP)
NetC6_4_2: C6_4.2 R6_4.1 ; port SLA_FILT4
NetC7_4_2: C7_4.2 U1_4.13(VREGH)
NetP1_4_1: P1_4.1 P1_4.2 Q2_4.3(S) Q4_4.4(D) U1_4.5(MOTXN)
NetP1_4_3: P1_4.3 P1_4.4 Q5_4.3(S) Q7_4.4(D) U1_4.35(MOTYP)
NetP1_4_5: P1_4.5 P1_4.6 Q1_4.3(S) Q3_4.4(D) U1_4.2(MOTXP)
NetP1_4_7: P1_4.7 P1_4.8 Q6_4.3(S) Q8_4.4(D) U1_4.32(MOTYN)
NetQ1_4_1: Q1_4.1(G) U1_4.3(GXTL)
NetQ2_4_1: Q2_4.1(G) U1_4.6(GXTR)
NetQ3_4_1: Q3_4.1(G) U1_4.48(GXBL)
NetQ3_4_3: Q3_4.3(S) Q4_4.3(S) R1_4.2 U1_4.7(RSENSXP)
NetQ4_4_1: Q4_4.1(G) U1_4.4(GXBR)
NetQ5_4_1: Q5_4.1(G) U1_4.34(GYTL)
NetQ6_4_1: Q6_4.1(G) U1_4.31(GYTR)
NetQ7_4_1: Q7_4.1(G) U1_4.36(GYBL)
NetQ7_4_3: Q7_4.3(S) Q8_4.3(S) R2_4.2 U1_4.30(RSENSYP)
NetQ8_4_1: Q8_4.1(G) U1_4.33(GYBR)
NetR3_4_1: R3_4.1 R4_4.2 U1_4.9(REF)
NetR6_4_2: R6_4.2 U1_4.14(SLA)
NetU1_4_15: U1_4.15(~{ERR}) ; port ERR4
NetU1_4_16: U1_4.16(CLR) ; port CLR4
NetU1_4_17: U1_4.17(~{WD}) ; port WD4
NetU1_4_18: U1_4.18(HOLDCUR) ; port HOLDCUR4
NetU1_4_22: U1_4.22(~{CS}) ; port STP4CS
NetU1_4_26: U1_4.26(NXT) ; port NXT4
NetU1_4_27: U1_4.27(DIR) ; port DIR4

Not connected (* = marked no-connect by the designer): U1_4 1(NC) 10(NC) 19(NC) 20(NC) 28(NC)* 37(NC)* 38(NC)* 39(NC)* 46(NC)* 47(NC)*

### Notes on the sheet
- (near R6_4) Position feedback filter
- Connect thermal pad (EP) to ground plane

### Library data of the parts
C1_4 = CMP-2000-06221-1: as C1_1 on sheet Stepping Motor DriverA; Manufacturer URL: http://www.panasonic.com/; Minimum Operating Temperature: -55C; Datasheet Version: 06/2016; Product Category: AluminumOrganicPolymerCapacitors; Maximum Operating Temperature: +105C; Package Description: 2-Pin Surface Mount Device, Body 10.3 x 10.3 mm; Package Reference: ZA-G; RoHS: Details; Series: ZA; Tolerance: 20%; Product: AluminumElectrolyticCapacitors; Factory Pack Quantity: 500; Manufacturer: Panasonic; Termination Style: SMD/SMT; Datasheet URL: https://industrial.panasonic.com/cdbs/www-data/pdf/RDD0000/DMD0000COL56.pdf; Mounting Technology: SurfaceMount; Packaging: Reel; Height: 10.5mm
C2_4 C3_4 = CMP-1036-04556-1: as C2_1 on sheet Stepping Motor DriverA; Technology: SMT; Max Thickness: 0.75 mm; Rated Voltage: 50 V; Tolerance: -20% to +80%
C4_4 C5_4 = CMP-1040-01292-1: as C4_1 on sheet Stepping Motor DriverA; Rated Voltage: 50 V; Technology: SMT; Max Thickness: 1.1 mm
C6_4 = CMP-1037-02447-1: as C6_1 on sheet Stepping Motor DriverA; Technology: SMT; Max Thickness: 1.7 mm; Rated Voltage: 50 V
C7_4 = CMP-1042-00755-1: as C7_1 on sheet Stepping Motor DriverA; Rated Voltage: 50 V; Max Thickness: 2.2 mm; Technology: SMT
D1_4 = CMP-1055-00174-1: as D1_1 on sheet Stepping Motor DriverA; ComponentLink2URL: http://www.onsemi.cn/pub_link/Collateral/MBRB1045-D.PDF; PackageVersion: Rev. E, 02/2014; PackageDescription: 3-Pin Flange Mount, Body 6.54 x 6.095 mm, Pitch 2.29 mm; ComponentLink2Description: Datasheet; Packing: Tube; RoHS: TRUE; ComponentLink3Description: Package Specification; PackageReference: DPAK-3-369C-01; ComponentLink1URL: http://www.onsemi.com/; DatasheetVersion: Rev. 8; ComponentLink1Description: Manufacturer URL; PartNumber: MBRD1045G; Mounting Technology: Surface Mount; ComponentLink3URL: http://www.onsemi.cn/pub_link/Collateral/369C.PDF
P1_4 = 1-1376350-9: as P1_1 on sheet Stepping Motor DriverA; Copyright: Copyright (C) 2018 Accelerated Designs. All rights reserved; Manufacturer_Part_Number: 1-1376350-9; Datasheet: https://www.te.com/commerce/DocumentDelivery/DDEController?Action=showdoc&DocId=Customer+Drawing%7F1376350%7FD5%7Fpdf%7FJapanese%7FJPN_CD_1376350_D5.pdf%7F1-1376350-2; TE_Part_Number: 1-1376350-9; PRODUCT: -; Type: DEV; RefDes: RefDes; Value: Value
Q1_4 Q2_4 Q3_4 Q4_4 Q5_4 Q6_4 Q7_4 Q8_4 = CMP-1058-00298-1: as Q1_1 on sheet Stepping Motor DriverA; RoHS: Pb-Free; ComponentLink3Description: Package Specification; ComponentLink2URL: http://www.onsemi.cn/pub_link/Collateral/NTD4815N-D.PDF; ComponentLink1Description: Manufacturer URL; DatasheetVersion: Rev. 7; ComponentLink3URL: http://www.onsemi.cn/pub_link/Collateral/369AA.PDF; Package Type: DPAK-3, IPAK-3; PartNumber: NTD4815NT4G; Configuration: Single; PackageVersion: Rev. B, 06/2010; ComponentLink2Description: Datasheet; Mounting Technology: Surface Mount; PackageReference: DPAK-3-369AA-01; ComponentLink1URL: http://www.onsemi.com/; PackageDescription: 3-Pin Flange Mount, Body 6.54 x 6.095 mm, Pitch 2.29 mm; Packing: Tape and Reel
R1_4 R2_4 = CMP-2000-07420-1: as R1_1 on sheet Stepping Motor DriverA; Manufacturer URL: http://www.vishay.com/; Datasheet Version: 07/2016; Package Reference: 2512; Resistance Tolerance: ±1%; Datasheet URL: http://www.vishay.com/docs/30100/wsl.pdf; Mounting Technology: SurfaceMount; MSL: MSL1-Unlimited; Package Description: 2-Pin Surface Mount Device, Body 6.35 x 3.18 mm; Packaging: CutTape
R3_4 = CMP-1013-00510-1: as R3_1 on sheet Stepping Motor DriverA; Tolerance: 1 %; Power: 0.125 W; Technology: SMT
R4_4 = CMP-1013-00528-1: as R4_1 on sheet Stepping Motor DriverA; Technology: SMT; Power: 0.125 W; Tolerance: 1 %
R6_4 = CMP-1013-00595-1: as R6_1 on sheet Stepping Motor DriverA; Technology: SMT; Power: 0.125 W; Tolerance: 1 %
U1_4 = CMP-1325-00002-1: as U1_1 on sheet Stepping Motor DriverA; ComponentLink1Description: Manufacturer URL; DatasheetVersion: Rev. 0; PackageDescription: 48-Pin Quad Flat No-Lead Package, Body 7 x 7 mm, Pitch 0.5 mm; Packing: Tape and Reel; Mounting Technology: Surface Mount; ComponentLink2Description: Datasheet; ComponentLink3URL: http://www.onsemi.cn/pub_link/Collateral/485AJ.PDF; Type: Stepper; ComponentLink2URL: http://www.onsemi.com/pub_link/Collateral/AMIS-30422-D.PDF; ComponentLink3Description: Package Specification; PackageReference: QFN-48-485AJ-01; PartNumber: AMIS30422C422MNTWG; PackageVersion: Rev. O; ComponentLink1URL: http://www.onsemi.com/; RoHS: TRUE; PartId: 1

## Sheet Stepping Motor DriverE.SchDoc
size A4
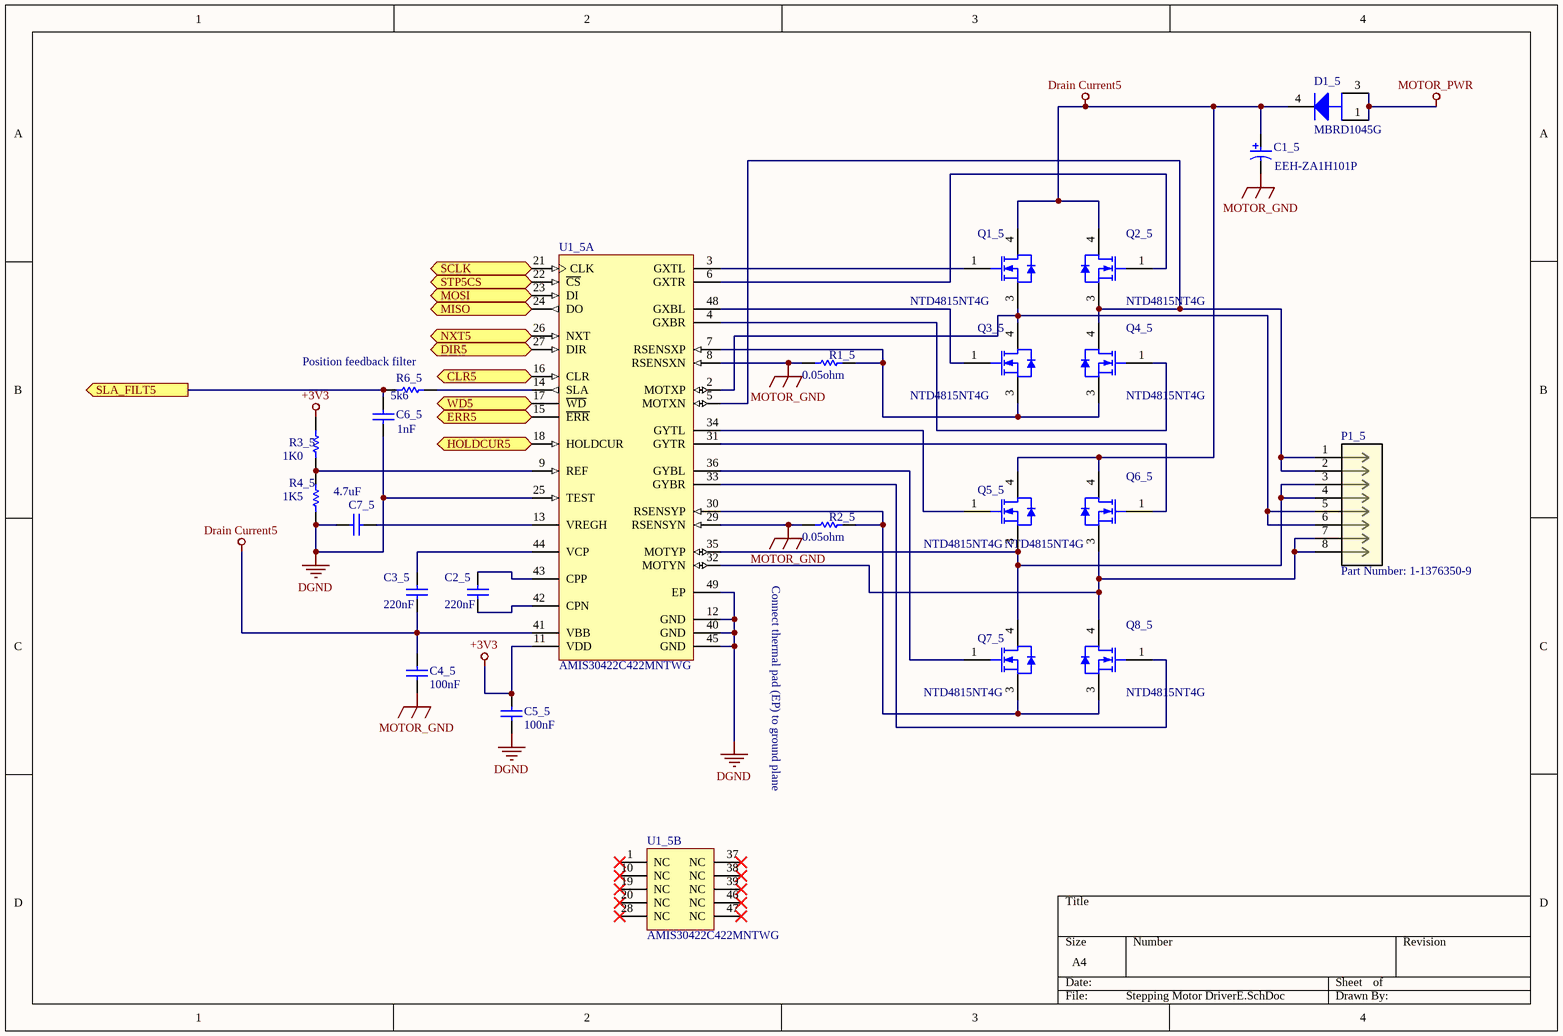
[diagram p4: Stepping Motor DriverE.SchDoc]

### Parts
C1_5  EEH-ZA1H101P  [PNSC-ZA-G_L]
C2_5  value 220nF  [CAPC0805(2012)75_L]  (hidden comment: CAP 220nF 50V 0805(2012))
C3_5  value 220nF  [CAPC0805(2012)75_L]  (hidden comment: CAP 220nF 50V 0805(2012))
C4_5  value 100nF  [CAPC1812(4532)110_N]  (hidden comment: CAP 100nF 50V 1812(4532))
C5_5  value 100nF  [CAPC1812(4532)110_N]  (hidden comment: CAP 100nF 50V 1812(4532))
C6_5  value 1nF  [CAPC1206(3216)170_N]  (hidden comment: CAP 1nF 50V 1206(3216))
C7_5  value 4.7uF  [CAPC2220(5750)230_L]  (hidden comment: CAP 4.7uF 50V 2220(5750))
D1_5  MBRD1045G  [ONSC-DPAK-3-369C-01_V]
P1_5  Part Number: 1-1376350-9  [conn8_1-1376350-]
Q1_5  NTD4815NT4G  [ONSC-DPAK-3-369AA-01_V]
Q2_5  NTD4815NT4G  [ONSC-DPAK-3-369AA-01_V]
Q3_5  NTD4815NT4G  [ONSC-DPAK-3-369AA-01_V]
Q4_5  NTD4815NT4G  [ONSC-DPAK-3-369AA-01_V]
Q5_5  NTD4815NT4G  [ONSC-DPAK-3-369AA-01_V]
Q6_5  NTD4815NT4G  [ONSC-DPAK-3-369AA-01_V]
Q7_5  NTD4815NT4G  [ONSC-DPAK-3-369AA-01_V]
Q8_5  NTD4815NT4G  [ONSC-DPAK-3-369AA-01_V]
R1_5  Resistance: 0.05ohm  [RESC6432X89X76LL25T25]  (hidden comment: WSL2512R0500FEA)
R2_5  Resistance: 0.05ohm  [RESC6432X89X76LL25T25]  (hidden comment: WSL2512R0500FEA)
R3_5  value 1K0  [RESC0805(2012)_M]  (hidden comment: 1K 1% 0805(2012))
R4_5  value 1K5  [RESC0805(2012)_M]  (hidden comment: 1K5 1% 0805(2012))
R6_5  value 5k6  [RESC0805(2012)_L]  (hidden comment: 5K6 1% 0805(2012))
U1_5  AMIS30422C422MNTWG  [ONSC-QFN-48-485AJ-01_V]  (parts A,B of 2)

### Ports
CLR5 (in), DIR5 (in), ERR5 (out), HOLDCUR5 (in), MISO (out), MOSI (in), NXT5 (in), SCLK (in), SLA_FILT5 (out), STP5CS (in), WD5 (out)

### Nets
+3V3: C5_5.2 R3_5.2 U1_5.11(VDD)
DGND: C5_5.1 C6_5.1 C7_5.1 R4_5.1 U1_5.12(GND) U1_5.25(TEST) U1_5.40(GND) U1_5.45(GND) U1_5.49(EP)
Drain Current5: C1_5.1 C3_5.1 C4_5.2 D1_5.4(K) Q1_5.4(D) Q2_5.4(D) Q5_5.4(D) Q6_5.4(D) U1_5.41(VBB)
MOTOR_GND: C1_5.2 C4_5.1 R1_5.1 R2_5.1 U1_5.8(RSENSXN) U1_5.29(RSENSYN)
MOTOR_PWR: D1_5.1(A) D1_5.3(A)
MISO: U1_5.24(DO) ; port MISO
MOSI: U1_5.23(DI) ; port MOSI
SCLK: U1_5.21(CLK) ; port SCLK
NetC2_5_1: C2_5.1 U1_5.42(CPN)
NetC2_5_2: C2_5.2 U1_5.43(CPP)
NetC3_5_2: C3_5.2 U1_5.44(VCP)
NetC6_5_2: C6_5.2 R6_5.1 ; port SLA_FILT5
NetC7_5_2: C7_5.2 U1_5.13(VREGH)
NetP1_5_1: P1_5.1 P1_5.2 Q2_5.3(S) Q4_5.4(D) U1_5.5(MOTXN)
NetP1_5_3: P1_5.3 P1_5.4 Q5_5.3(S) Q7_5.4(D) U1_5.35(MOTYP)
NetP1_5_5: P1_5.5 P1_5.6 Q1_5.3(S) Q3_5.4(D) U1_5.2(MOTXP)
NetP1_5_7: P1_5.7 P1_5.8 Q6_5.3(S) Q8_5.4(D) U1_5.32(MOTYN)
NetQ1_5_1: Q1_5.1(G) U1_5.3(GXTL)
NetQ2_5_1: Q2_5.1(G) U1_5.6(GXTR)
NetQ3_5_1: Q3_5.1(G) U1_5.48(GXBL)
NetQ3_5_3: Q3_5.3(S) Q4_5.3(S) R1_5.2 U1_5.7(RSENSXP)
NetQ4_5_1: Q4_5.1(G) U1_5.4(GXBR)
NetQ5_5_1: Q5_5.1(G) U1_5.34(GYTL)
NetQ6_5_1: Q6_5.1(G) U1_5.31(GYTR)
NetQ7_5_1: Q7_5.1(G) U1_5.36(GYBL)
NetQ7_5_3: Q7_5.3(S) Q8_5.3(S) R2_5.2 U1_5.30(RSENSYP)
NetQ8_5_1: Q8_5.1(G) U1_5.33(GYBR)
NetR3_5_1: R3_5.1 R4_5.2 U1_5.9(REF)
NetR6_5_2: R6_5.2 U1_5.14(SLA)
NetU1_5_15: U1_5.15(~{ERR}) ; port ERR5
NetU1_5_16: U1_5.16(CLR) ; port CLR5
NetU1_5_17: U1_5.17(~{WD}) ; port WD5
NetU1_5_18: U1_5.18(HOLDCUR) ; port HOLDCUR5
NetU1_5_22: U1_5.22(~{CS}) ; port STP5CS
NetU1_5_26: U1_5.26(NXT) ; port NXT5
NetU1_5_27: U1_5.27(DIR) ; port DIR5

Not connected (* = marked no-connect by the designer): U1_5 1(NC)* 10(NC)* 19(NC)* 20(NC)* 28(NC)* 37(NC)* 38(NC)* 39(NC)* 46(NC)* 47(NC)*

### Notes on the sheet
- (near R6_5) Position feedback filter
- Connect thermal pad (EP) to ground plane

### Library data of the parts
C1_5 = CMP-2000-06221-1: as C1_1 on sheet Stepping Motor DriverA; Manufacturer URL: http://www.panasonic.com/; Minimum Operating Temperature: -55C; Datasheet Version: 06/2016; Product Category: AluminumOrganicPolymerCapacitors; Maximum Operating Temperature: +105C; Package Description: 2-Pin Surface Mount Device, Body 10.3 x 10.3 mm; Package Reference: ZA-G; RoHS: Details; Series: ZA; Tolerance: 20%; Product: AluminumElectrolyticCapacitors; Factory Pack Quantity: 500; Manufacturer: Panasonic; Termination Style: SMD/SMT; Datasheet URL: https://industrial.panasonic.com/cdbs/www-data/pdf/RDD0000/DMD0000COL56.pdf; Mounting Technology: SurfaceMount; Packaging: Reel; Height: 10.5mm
C2_5 C3_5 = CMP-1036-04556-1: as C2_1 on sheet Stepping Motor DriverA; Technology: SMT; Max Thickness: 0.75 mm; Rated Voltage: 50 V; Tolerance: -20% to +80%
C4_5 C5_5 = CMP-1040-01292-1: as C4_1 on sheet Stepping Motor DriverA; Rated Voltage: 50 V; Technology: SMT; Max Thickness: 1.1 mm
C6_5 = CMP-1037-02447-1: as C6_1 on sheet Stepping Motor DriverA; Technology: SMT; Max Thickness: 1.7 mm; Rated Voltage: 50 V
C7_5 = CMP-1042-00755-1: as C7_1 on sheet Stepping Motor DriverA; Rated Voltage: 50 V; Max Thickness: 2.2 mm; Technology: SMT
D1_5 = CMP-1055-00174-1: as D1_1 on sheet Stepping Motor DriverA; ComponentLink2URL: http://www.onsemi.cn/pub_link/Collateral/MBRB1045-D.PDF; PackageVersion: Rev. E, 02/2014; PackageDescription: 3-Pin Flange Mount, Body 6.54 x 6.095 mm, Pitch 2.29 mm; ComponentLink2Description: Datasheet; Packing: Tube; RoHS: TRUE; ComponentLink3Description: Package Specification; PackageReference: DPAK-3-369C-01; ComponentLink1URL: http://www.onsemi.com/; DatasheetVersion: Rev. 8; ComponentLink1Description: Manufacturer URL; PartNumber: MBRD1045G; Mounting Technology: Surface Mount; ComponentLink3URL: http://www.onsemi.cn/pub_link/Collateral/369C.PDF
P1_5 = 1-1376350-9: as P1_1 on sheet Stepping Motor DriverA; Copyright: Copyright (C) 2018 Accelerated Designs. All rights reserved; Manufacturer_Part_Number: 1-1376350-9; Datasheet: https://www.te.com/commerce/DocumentDelivery/DDEController?Action=showdoc&DocId=Customer+Drawing%7F1376350%7FD5%7Fpdf%7FJapanese%7FJPN_CD_1376350_D5.pdf%7F1-1376350-2; TE_Part_Number: 1-1376350-9; PRODUCT: -; Type: DEV; RefDes: RefDes; Value: Value
Q1_5 Q2_5 Q3_5 Q4_5 Q5_5 Q6_5 Q7_5 Q8_5 = CMP-1058-00298-1: as Q1_1 on sheet Stepping Motor DriverA; RoHS: Pb-Free; ComponentLink3Description: Package Specification; ComponentLink2URL: http://www.onsemi.cn/pub_link/Collateral/NTD4815N-D.PDF; ComponentLink1Description: Manufacturer URL; DatasheetVersion: Rev. 7; ComponentLink3URL: http://www.onsemi.cn/pub_link/Collateral/369AA.PDF; Package Type: DPAK-3, IPAK-3; PartNumber: NTD4815NT4G; Configuration: Single; PackageVersion: Rev. B, 06/2010; ComponentLink2Description: Datasheet; Mounting Technology: Surface Mount; PackageReference: DPAK-3-369AA-01; ComponentLink1URL: http://www.onsemi.com/; PackageDescription: 3-Pin Flange Mount, Body 6.54 x 6.095 mm, Pitch 2.29 mm; Packing: Tape and Reel
R1_5 R2_5 = CMP-2000-07420-1: as R1_1 on sheet Stepping Motor DriverA; Manufacturer URL: http://www.vishay.com/; Datasheet Version: 07/2016; Package Reference: 2512; Resistance Tolerance: ±1%; Datasheet URL: http://www.vishay.com/docs/30100/wsl.pdf; Mounting Technology: SurfaceMount; MSL: MSL1-Unlimited; Package Description: 2-Pin Surface Mount Device, Body 6.35 x 3.18 mm; Packaging: CutTape
R3_5 = CMP-1013-00510-1: as R3_1 on sheet Stepping Motor DriverA; Tolerance: 1 %; Power: 0.125 W; Technology: SMT
R4_5 = CMP-1013-00528-1: as R4_1 on sheet Stepping Motor DriverA; Technology: SMT; Power: 0.125 W; Tolerance: 1 %
R6_5 = CMP-1013-00595-1: as R6_1 on sheet Stepping Motor DriverA; Technology: SMT; Power: 0.125 W; Tolerance: 1 %
U1_5 = CMP-1325-00002-1: as U1_1 on sheet Stepping Motor DriverA; ComponentLink1Description: Manufacturer URL; DatasheetVersion: Rev. 0; PackageDescription: 48-Pin Quad Flat No-Lead Package, Body 7 x 7 mm, Pitch 0.5 mm; Packing: Tape and Reel; Mounting Technology: Surface Mount; ComponentLink2Description: Datasheet; ComponentLink3URL: http://www.onsemi.cn/pub_link/Collateral/485AJ.PDF; Type: Stepper; ComponentLink2URL: http://www.onsemi.com/pub_link/Collateral/AMIS-30422-D.PDF; ComponentLink3Description: Package Specification; PackageReference: QFN-48-485AJ-01; PartNumber: AMIS30422C422MNTWG; PackageVersion: Rev. O; ComponentLink1URL: http://www.onsemi.com/; RoHS: TRUE; PartId: 1